# EAGLE schematic Strain_gauge (EAGLE 7.5.0)
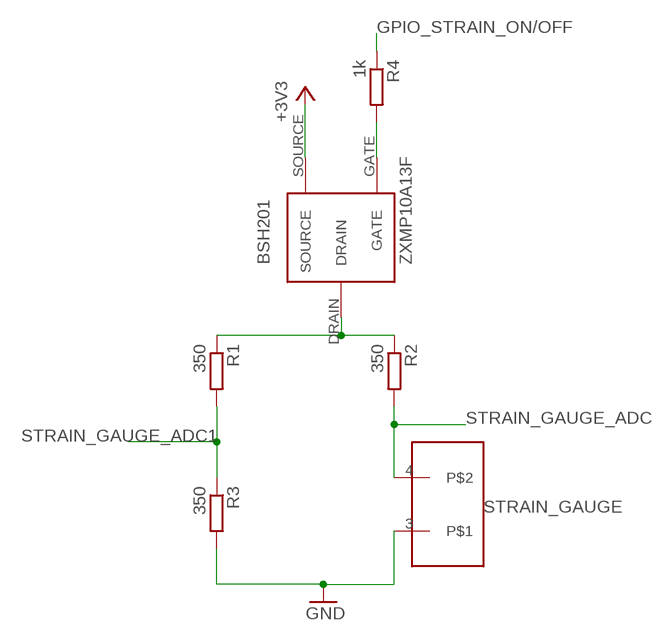
[diagram p0: schematic, sheet 1]

## Parts
BSH201  ZXMP10A13F  [P-CHANNEL]
R1  350  R-EU_R0805  [R0805]
R2  350  R-EU_R0805  [R0805]
R3  350  R-EU_R0805  [R0805]
R4  1k  R-EU_R0805  [R0805]
SKRUVPLINT_2P1  SKRUVPLINT_2P  [SKRUVPLINT_2P]

## Nets
+3V3: BSH201.SOURCE
GPIO_STRAIN_ON/OFF: R4.1
N$1: BSH201.DRAIN R1.1 R2.1
N$2: BSH201.GATE R4.2
STRAIN_GAUGE: R3.2 SKRUVPLINT_2P1.3 ; supply symbol labelled GND
STRAIN_GAUGE_ADC1: R1.2 R3.1
STRAIN_GAUGE_ADC2: R2.2 SKRUVPLINT_2P1.4

## Library data of the parts
BSH201 = ZXMP10A13F:ZXMP10A13F
R1-R4 = rcl:R-EU_: RESISTOR, European symbol
SKRUVPLINT_2P1 = skruvplint2p_CTB0700:SKRUVPLINT_2P